# Altium schematic sheet pcb_v1.SchDoc
size A2; SheetNumber: 1; SheetTotal: 1
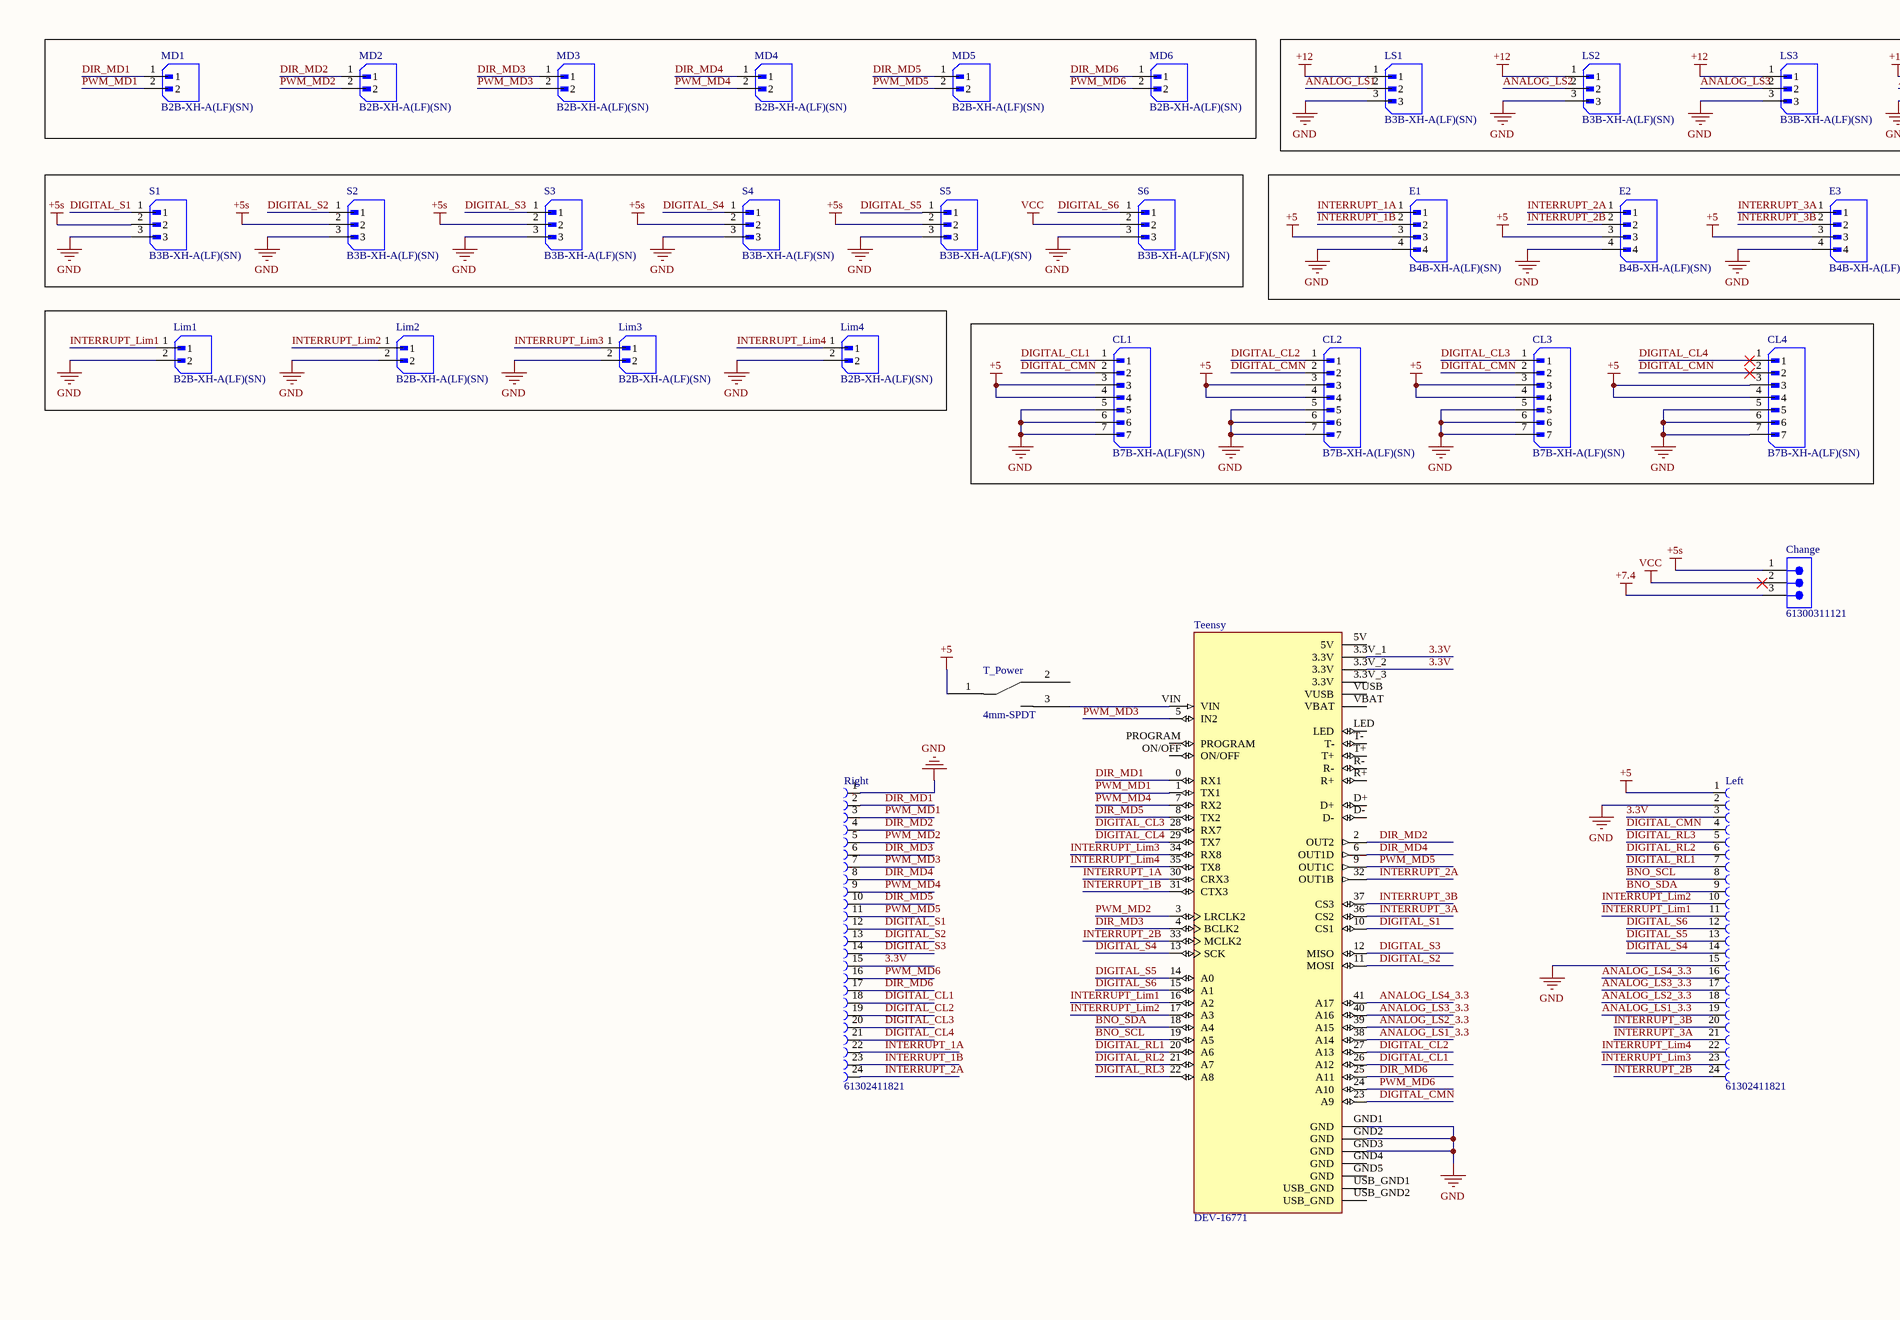
[diagram p0: pcb_v1.SchDoc, left]
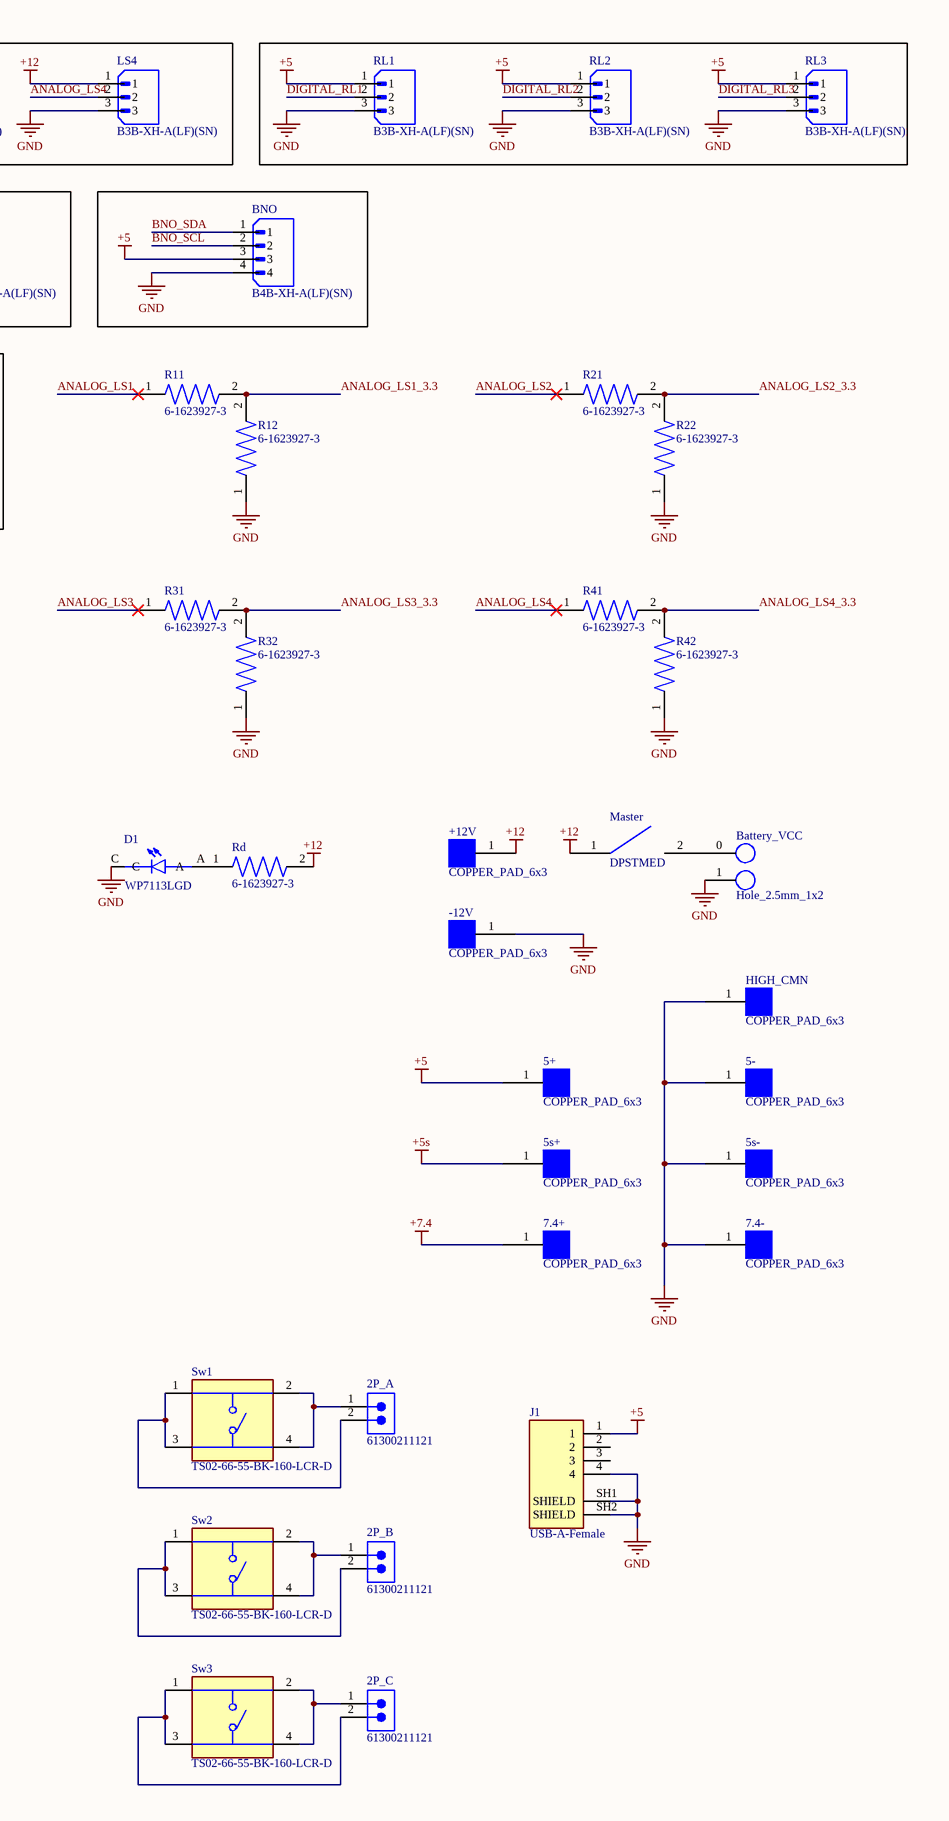
[diagram p1: pcb_v1.SchDoc, right]

## Parts
2P_A  61300211121  [61300211121]
2P_B  61300211121  [61300211121]
2P_C  61300211121  [61300211121]
5+  COPPER_PAD_6x3  [COPPER_PAD-Footprint-1]
5-  COPPER_PAD_6x3  [COPPER_PAD-Footprint-1]
5s+  COPPER_PAD_6x3  [COPPER_PAD-Footprint-1]
5s-  COPPER_PAD_6x3  [COPPER_PAD-Footprint-1]
7.4+  COPPER_PAD_6x3  [COPPER_PAD-Footprint-1]
7.4-  COPPER_PAD_6x3  [COPPER_PAD-Footprint-1]
+12V  COPPER_PAD_6x3  [COPPER_PAD-Footprint-1]
-12V  COPPER_PAD_6x3  [COPPER_PAD-Footprint-1]
Battery_VCC  Hole_2.5mm_1x2  [Hole_2.5mm_1x2-Footprint-1]
BNO  B4B-XH-A(LF)(SN)  [JST_B4B-XH-A(LF)(SN)]
Change  61300311121  [61300311121]
CL1  B7B-XH-A(LF)(SN)  [JST_B7B-XH-A(LF)(SN)]
CL2  B7B-XH-A(LF)(SN)  [JST_B7B-XH-A(LF)(SN)]
CL3  B7B-XH-A(LF)(SN)  [JST_B7B-XH-A(LF)(SN)]
CL4  B7B-XH-A(LF)(SN)  [JST_B7B-XH-A(LF)(SN)]
D1  WP7113LGD  [LED_WP7113LGD]
E1  B4B-XH-A(LF)(SN)  [JST_B4B-XH-A(LF)(SN)]
E2  B4B-XH-A(LF)(SN)  [JST_B4B-XH-A(LF)(SN)]
E3  B4B-XH-A(LF)(SN)  [JST_B4B-XH-A(LF)(SN)]
HIGH_CMN  COPPER_PAD_6x3  [COPPER_PAD-Footprint-1]
J1  USB-A-Female  [CUI_UJ2-AH-4-TH]
Left  61302411821  [61302411821]
Lim1  B2B-XH-A(LF)(SN)  [JST_B2B-XH-A(LF)(SN)]
Lim2  B2B-XH-A(LF)(SN)  [JST_B2B-XH-A(LF)(SN)]
Lim3  B2B-XH-A(LF)(SN)  [JST_B2B-XH-A(LF)(SN)]
Lim4  B2B-XH-A(LF)(SN)  [JST_B2B-XH-A(LF)(SN)]
LS1  B3B-XH-A(LF)(SN)  [JST_B3B-XH-A(LF)(SN)]
LS2  B3B-XH-A(LF)(SN)  [JST_B3B-XH-A(LF)(SN)]
LS3  B3B-XH-A(LF)(SN)  [JST_B3B-XH-A(LF)(SN)]
LS4  B3B-XH-A(LF)(SN)  [JST_B3B-XH-A(LF)(SN)]
Master  DPSTMED  [SPSTMED-Footprint-1]
MD1  B2B-XH-A(LF)(SN)  [JST_B2B-XH-A(LF)(SN)]
MD2  B2B-XH-A(LF)(SN)  [JST_B2B-XH-A(LF)(SN)]
MD3  B2B-XH-A(LF)(SN)  [JST_B2B-XH-A(LF)(SN)]
MD4  B2B-XH-A(LF)(SN)  [JST_B2B-XH-A(LF)(SN)]
MD5  B2B-XH-A(LF)(SN)  [JST_B2B-XH-A(LF)(SN)]
MD6  B2B-XH-A(LF)(SN)  [JST_B2B-XH-A(LF)(SN)]
R11  6-1623927-3  [RESAD700W45L350D185]
R12  6-1623927-3  [RESAD700W45L350D185]
R21  6-1623927-3  [RESAD700W45L350D185]
R22  6-1623927-3  [RESAD700W45L350D185]
R31  6-1623927-3  [RESAD700W45L350D185]
R32  6-1623927-3  [RESAD700W45L350D185]
R41  6-1623927-3  [RESAD700W45L350D185]
R42  6-1623927-3  [RESAD700W45L350D185]
Rd  6-1623927-3  [RESAD700W45L350D185]
Right  61302411821  [61302411821]
RL1  B3B-XH-A(LF)(SN)  [JST_B3B-XH-A(LF)(SN)]
RL2  B3B-XH-A(LF)(SN)  [JST_B3B-XH-A(LF)(SN)]
RL3  B3B-XH-A(LF)(SN)  [JST_B3B-XH-A(LF)(SN)]
S1  B3B-XH-A(LF)(SN)  [JST_B3B-XH-A(LF)(SN)]
S2  B3B-XH-A(LF)(SN)  [JST_B3B-XH-A(LF)(SN)]
S3  B3B-XH-A(LF)(SN)  [JST_B3B-XH-A(LF)(SN)]
S4  B3B-XH-A(LF)(SN)  [JST_B3B-XH-A(LF)(SN)]
S5  B3B-XH-A(LF)(SN)  [JST_B3B-XH-A(LF)(SN)]
S6  B3B-XH-A(LF)(SN)  [JST_B3B-XH-A(LF)(SN)]
Sw1  TS02-66-55-BK-160-LCR-D  [SW_TS02-66-55-BK-160-LCR-D]
Sw2  TS02-66-55-BK-160-LCR-D  [SW_TS02-66-55-BK-160-LCR-D]
Sw3  TS02-66-55-BK-160-LCR-D  [SW_TS02-66-55-BK-160-LCR-D]
T_Power  4mm-SPDT  [4mm-SPDT-Footprint-1]
Teensy  DEV-16771  [MODULE_DEV-16771]

## Nets
+5: 5+.1 BNO.3 CL1.3 CL1.4 CL2.3 CL2.4 CL3.3 CL3.4 CL4.3 CL4.4 E1.3 E2.3 E3.3 J1.1 Left.1 RL1.1 RL2.1 RL3.1 T_Power.1
+5s: 5s+.1 Change.1 S1.2 S2.2 S3.2 S4.2 S5.2
+7.4: 7.4+.1 Change.3
+12: +12V.1 LS1.1 LS2.1 LS3.1 LS4.1 Master.1 Rd.2
GND: 5-.1 5s-.1 7.4-.1 -12V.1 Battery_VCC.1 BNO.4 CL1.5 CL1.6 CL1.7 CL2.5 CL2.6 CL2.7 CL3.5 CL3.6 CL3.7 CL4.5 CL4.6 CL4.7 D1.C E1.4 E2.4 E3.4 HIGH_CMN.1 J1.4 J1.SH1(SHIELD) J1.SH2(SHIELD) Left.2 Left.15 Lim1.2 Lim2.2 Lim3.2 Lim4.2 LS1.3 LS2.3 LS3.3 LS4.3 R12.1 R22.1 R32.1 R42.1 Right.1 RL1.3 RL2.3 RL3.3 S1.3 S2.3 S3.3 S4.3 S5.3 S6.3 Teensy.GND1(GND) Teensy.GND2(GND) Teensy.GND3(GND)
VCC: Change.2 S6.2
3.3V: Left.3 Right.15 Teensy.3.3V_1(3.3V) Teensy.3.3V_2(3.3V)
ANALOG_LS1: LS1.2 R11.1
ANALOG_LS1_3.3: Left.19 R11.2 R12.2 Teensy.38(A14)
ANALOG_LS2: LS2.2 R21.1
ANALOG_LS2_3.3: Left.18 R21.2 R22.2 Teensy.39(A15)
ANALOG_LS3: LS3.2 R31.1
ANALOG_LS3_3.3: Left.17 R31.2 R32.2 Teensy.40(A16)
ANALOG_LS4: LS4.2 R41.1
ANALOG_LS4_3.3: Left.16 R41.2 R42.2 Teensy.41(A17)
BNO_SCL: BNO.2 Left.8 Teensy.19(A5)
BNO_SDA: BNO.1 Left.9 Teensy.18(A4)
DIGITAL_CL1: CL1.1 Right.18 Teensy.26(A12)
DIGITAL_CL2: CL2.1 Right.19 Teensy.27(A13)
DIGITAL_CL3: CL3.1 Right.20 Teensy.28(RX7)
DIGITAL_CL4: CL4.1 Right.21 Teensy.29(TX7)
DIGITAL_CMN: CL1.2 CL2.2 CL3.2 CL4.2 Left.4 Teensy.23(A9)
DIGITAL_RL1: Left.7 RL1.2 Teensy.20(A6)
DIGITAL_RL2: Left.6 RL2.2 Teensy.21(A7)
DIGITAL_RL3: Left.5 RL3.2 Teensy.22(A8)
DIGITAL_S1: Right.12 S1.1 Teensy.10(CS1)
DIGITAL_S2: Right.13 S2.1 Teensy.11(MOSI)
DIGITAL_S3: Right.14 S3.1 Teensy.12(MISO)
DIGITAL_S4: Left.14 S4.1 Teensy.13(SCK)
DIGITAL_S5: Left.13 S5.1 Teensy.14(A0)
DIGITAL_S6: Left.12 S6.1 Teensy.15(A1)
DIR_MD1: MD1.1 Right.2 Teensy.0(RX1)
DIR_MD2: MD2.1 Right.4 Teensy.2(OUT2)
DIR_MD3: MD3.1 Right.6 Teensy.4(BCLK2)
DIR_MD4: MD4.1 Right.8 Teensy.6(OUT1D)
DIR_MD5: MD5.1 Right.10 Teensy.8(TX2)
DIR_MD6: MD6.1 Right.17 Teensy.25(A11)
INTERRUPT_1A: E1.1 Right.22 Teensy.30(CRX3)
INTERRUPT_1B: E1.2 Right.23 Teensy.31(CTX3)
INTERRUPT_2A: E2.1 Right.24 Teensy.32(OUT1B)
INTERRUPT_2B: E2.2 Left.24 Teensy.33(MCLK2)
INTERRUPT_3A: E3.1 Left.21 Teensy.36(CS2)
INTERRUPT_3B: E3.2 Left.20 Teensy.37(CS3)
INTERRUPT_Lim1: Left.11 Lim1.1 Teensy.16(A2)
INTERRUPT_Lim2: Left.10 Lim2.1 Teensy.17(A3)
INTERRUPT_Lim3: Left.23 Lim3.1 Teensy.34(RX8)
INTERRUPT_Lim4: Left.22 Lim4.1 Teensy.35(TX8)
PWM_MD1: MD1.2 Right.3 Teensy.1(TX1)
PWM_MD2: MD2.2 Right.5 Teensy.3(LRCLK2)
PWM_MD3: MD3.2 Right.7 Teensy.5(IN2)
PWM_MD4: MD4.2 Right.9 Teensy.7(RX2)
PWM_MD5: MD5.2 Right.11 Teensy.9(OUT1C)
PWM_MD6: MD6.2 Right.16 Teensy.24(A10)
Net2P_A_1: 2P_A.1 Sw1.2 Sw1.4
Net2P_A_2: 2P_A.2 Sw1.1 Sw1.3
Net2P_B_1: 2P_B.1 Sw2.2 Sw2.4
Net2P_B_2: 2P_B.2 Sw2.1 Sw2.3
Net2P_C_1: 2P_C.1 Sw3.2 Sw3.4
Net2P_C_2: 2P_C.2 Sw3.1 Sw3.3
NetBattery_VCC_0: Battery_VCC.0 Master.2
NetD1_A: D1.A Rd.1
NetT_Power_3: T_Power.3 Teensy.VIN

Not connected (* = marked no-connect by the designer): J1 2 3; T_Power 2; Teensy 3.3V_3(3.3V) 5V D+ D- GND4(GND) GND5(GND) LED ON/OFF PROGRAM R+ R- T+ T- USB_GND1(USB_GND) USB_GND2(USB_GND) VBAT VUSB

## Library data of the parts
2P_A 2P_B 2P_C = CMP-00005-1: THT Vertical Pin Header WR-PHD, Pitch 2.54 mm, Single Row, 2 pins; Gender: Male; Operating Supply Voltage: 250V; Current Rating: 3A; Number of Positions: 2; Pitch: 0.1inch; Contact Resistance: 20mR; Reach SVHC Compliant: Unknown; Height: 8.94mm; Contact Plating: Gold; Min Operating Temperature: -40°C; Number of Rows: 1; Voltage Rating: 250V; Contact Mating Length: 0.236inch; Contact Type: Male Pin; Contact Gender: Male; RoHS Compliant: Yes; Orientation: Vertical; Max Operating Temperature: 125°C; Packaging: Bulk; Color: Black; Series: WR-PHD; Housing Material: PBT; Mounting Technology: Through Hole; Contact Material: Copper Alloy,Copper; Termination: Through Hole; Lead Free: Lead Free; Number of Contacts: 2
5+ 5- 5s+ 5s- 7.4+ 7.4- +12V -12V HIGH_CMN = CMP-00013-1: Exposed 6mmx3mm copper pad for soldering wires directly onto PCBs
Battery_VCC = CMP-00014-1: 2.5mm radius hole for wiring
BNO E1-E3 = CMP-328-000000-1: Connector Header Through Hole 4 position 0.098 (2.50mm); MF: JST Sales; Pin Count: 4; Value: *; Check_prices: https://www.snapeda.com/parts/B4B-XH-A(LF)(SN)/JST+Sales+America+Inc./view-part/?ref=eda; SnapEDA_Link: https://www.snapeda.com/parts/B4B-XH-A(LF)(SN)/JST+Sales+America+Inc./view-part/?ref=snap; MP: B4B-XH-A(LF)(SN); Source: B4B-XH-A(LF)(SN).SchLib; Package: None; Component Type: Standard; Design Item ID: B4B-XH-A(LF)(SN)
Change = CMP-00001-1: THT Vertical Pin Header WR-PHD, Pitch 2.54 mm, Single Row, 3 pins; Contact Resistance: 20mR; Pitch: 0.1inch; Voltage Rating: 250V; Number of Contacts: 3; Current Rating: 3A; Gender: Male; Orientation: Vertical; Mounting Technology: Through Hole; Termination: Solder; Color: Black; Contact Material: Copper; Contact Plating: Gold; Max Operating Temperature: 105°C; Reach SVHC Compliant: Unknown; Height: 8.94mm; Packaging: Bulk; Lead Free: Lead Free; Contact Mating Length: 0.236inch; Number of Rows: 1; Contact Type: Male Pin; Operating Supply Voltage: 250V; Number of Positions: 3; Series: WR-PHD; RoHS Compliant: Yes; Min Operating Temperature: -40°C
CL1-CL4 = CMP-334-000000-1: Connector Header Through Hole 7 position 0.098 (2.50mm); MF: JST Sales; SnapEDA_Link: https://www.snapeda.com/parts/B7B-XH-A%20(LF)(SN)/JST+Sales+America+Inc./view-part/?ref=snap; Source: B7B-XH-A(LF)(SN).SchLib; Package: None; MP: B7B-XH-A (LF)(SN); Pin Count: 7; Design Item ID: B7B-XH-A(LF)(SN); Check_prices: https://www.snapeda.com/parts/B7B-XH-A%20(LF)(SN)/JST+Sales+America+Inc./view-part/?ref=eda; Value: *; Component Type: Standard
D1 = CMP-352-000000-1: Green 568nm LED Indication - Discrete 1.9V Radial; MF: Kingbright; Value: *; Component Type: Standard; Design Item ID: WP7113LGD; Package: Radial Kingbright; Price: None; Source: WP7113LGD.SchLib; SnapEDA_Link: https://www.snapeda.com/parts/WP7113LGD/Kingbright/view-part/?ref=snap; Check_prices: https://www.snapeda.com/parts/WP7113LGD/Kingbright/view-part/?ref=eda; Pin Count: 2; Availability: In Stock; Purchase-URL: https://pricing.snapeda.com/search/part/WP7113LGD/?ref=eda; MP: WP7113LGD
J1 = CMP-346-000000-4: Type A, USB 2.0, 1 A, Right Angle, Through Hole, USB Receptacle; MF: CUI Devices; Pin Count: 6; Check_prices: https://www.snapeda.com/parts/UJ2-AH-4-TH/CUI+Devices/view-part/?ref=eda; Purchase-URL: https://pricing.snapeda.com/search/part/UJ2-AH-4-TH/?ref=eda; Package: None; Value: *; Component Type: Standard; MP: UJ2-AH-4-TH; Digi-Key_Part_Number: 102-3994-ND; Source: UJ2-AH-4-TH.SchLib; CUI_purchase_URL: https://www.cuidevices.com/product/interconnect/connectors/usb-connectors/uj2-ah-4-th?utm_source=snapeda.com&utm_medium=referral&utm_campaign=snapedaBOM; SnapEDA_Link: https://www.snapeda.com/parts/UJ2-AH-4-TH/CUI+Devices/view-part/?ref=snap; Design Item ID: UJ2-AH-4-TH
Left Right = CMP-326-000000-1: Single Row / Straight / Without Shroud Female header Female 24; MF: WÃ¼rth Elektronik; Source: 61302411821.SchLib; Price: None; Component Type: Standard; Pin Count: 24; Package: None; MP: 61302411821; Design Item ID: 61302411821; SnapEDA_Link: https://www.snapeda.com/parts/61302411821/Wurth+Elektronik/view-part/?ref=snap; Check_prices: https://www.snapeda.com/parts/61302411821/Wurth+Elektronik/view-part/?ref=eda; Availability: In Stock; Value: *
Lim1-Lim4 MD1-MD6 = CMP-332-000000-1: Connector Header Through Hole 2 position 0.098 (2.50mm); MF: JST Sales America Inc.; Component Type: Standard; Value: *; Check_prices: https://www.snapeda.com/parts/B2B-XH-A(LF)(SN)/JST+Sales+America+Inc./view-part/?ref=eda; Package: None; MP: B2B-XH-A(LF)(SN); SnapEDA_Link: https://www.snapeda.com/parts/B2B-XH-A(LF)(SN)/JST+Sales+America+Inc./view-part/?ref=snap; Pin Count: 2; Source: B2B-XH-A(LF)(SN).SchLib; Design Item ID: B2B-XH-A(LF)(SN)
LS1-LS4 RL1-RL3 S1-S6 = CMP-330-000000-1: Connector Header Through Hole 3 position 0.098 (2.50mm); MF: JST Sales; Value: *; Check_prices: https://www.snapeda.com/parts/B3B-XH-A(LF)(SN)/JST+Sales+America+Inc./view-part/?ref=eda; Component Type: Standard; Source: B3B-XH-A(LF)(SN).SchLib; MP: B3B-XH-A(LF)(SN); Design Item ID: B3B-XH-A(LF)(SN); SnapEDA_Link: https://www.snapeda.com/parts/B3B-XH-A(LF)(SN)/JST+Sales+America+Inc./view-part/?ref=snap; Pin Count: 3; Package: None
Master = CMP-00012-2: Medium Sized DPST switch
R11 R12 R21 R22 R31 R32 R41 R42 Rd = CMP-340-000000-1: CFR16 5% 10K; MP: 6-1623927-3; Package: None; Source: 6-1623927-3.SchLib; Component Type: Standard; Price: None; Availability: Unavailable; Design Item ID: 6-1623927-3; Pin Count: 2; Value: *
Sw1-Sw3 = CMP-342-000000-1: Package: None; MP: TS02-66-55-BK-160-LCR-D; Value: *; Component Type: Standard; Price: None; Source: TS02-66-55-BK-160-LCR-D.SchLib; Design Item ID: TS02-66-55-BK-160-LCR-D; Availability: Unavailable; Pin Count: 4
T_Power = CMP-00016-2: 4mm Single Pole Double Throw Switch
Teensy = CMP-322-000000-1: RT1062 Teensy 4.1 series ARMÂ® CortexÂ®-M7 MPU Embedded Evaluation Board; MF: SparkFun Electronics; SnapEDA_Link: https://www.snapeda.com/parts/DEV-16771/SparkFun+Electronics/view-part/?ref=snap; Pin Count: 65; Purchase-URL: https://pricing.snapeda.com/search/part/DEV-16771/?ref=eda; Value: *; Component Type: Standard; Availability: In Stock; Design Item ID: DEV-16771; Package: None; MP: DEV-16771; Source: DEV-16771.SchLib; Check_prices: https://www.snapeda.com/parts/DEV-16771/SparkFun+Electronics/view-part/?ref=eda; Price: None